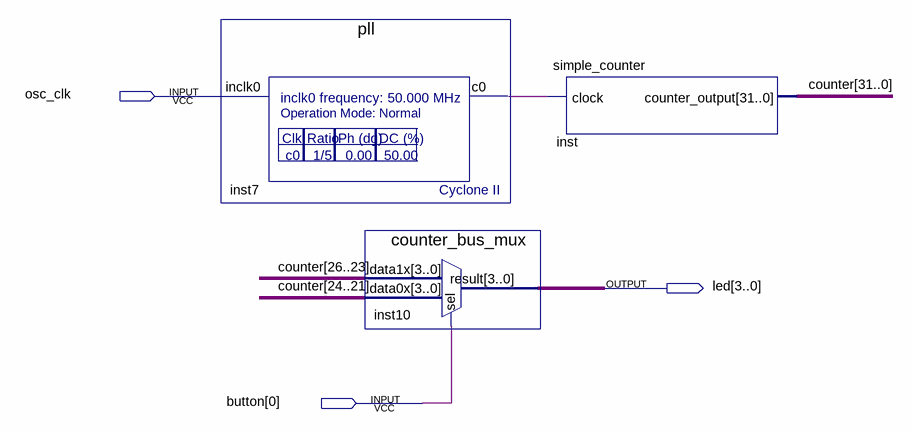
[diagram p0: schematic sheet]
// Quartus schematic AkiraKadai.bdf as structural Verilog: 3 symbols, 3 pins
module AkiraKadai (
  input  osc_clk,
  input  [0:0] button,
  output [3:0] led
);

  wire inst7_c0;
  wire [31:0] counter;

  pll inst7 (.inclk0(osc_clk), .c0(inst7_c0));
  counter_bus_mux inst10 (.data1x(counter[26:23]), .data0x(counter[24:21]), .sel(button[0]), .result(led));
  simple_counter inst (.clock(inst7_c0), .counter_output(counter));
endmodule
